# EAGLE design ESP_01_5V (EAGLE 7.2.0)
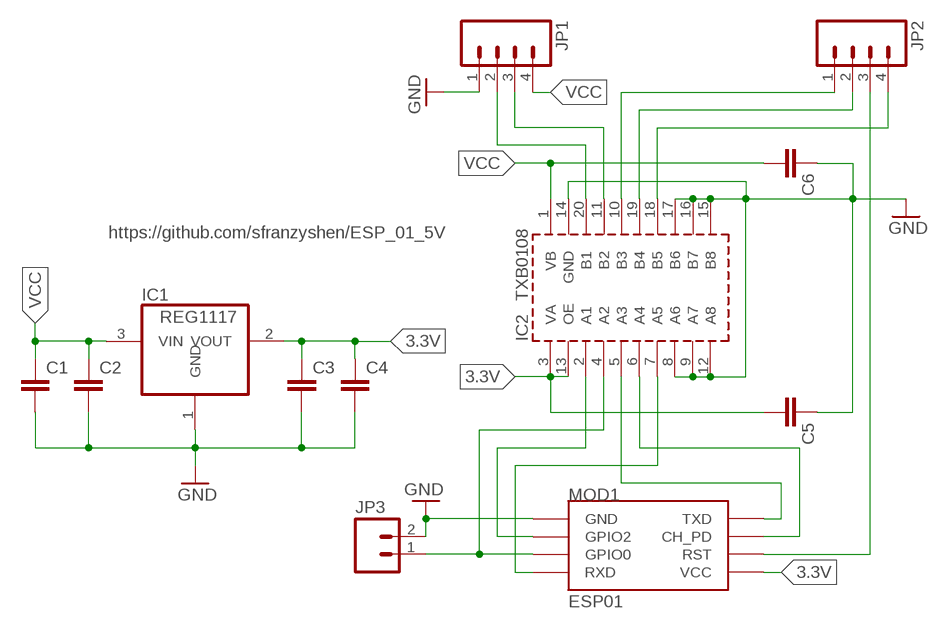
[diagram p0: schematic, sheet 1]

## Parts
C1  CAP0603-CAP  [0603-CAP]
C2  CAP0603-CAP  [0603-CAP]
C3  CAP0603-CAP  [0603-CAP]
C4  CAP0603-CAP  [0603-CAP]
C5  CAP0603-CAP  [0603-CAP]
C6  CAP0603-CAP  [0603-CAP]
IC1  REG1117  [SOT223]
IC2  IC_TXB0108-TSSOP-20  [TSSOP-20]
JP1  .1" 4 Pin Male  M04PTH  [1X04]
JP2  .1" 4 Pin Male  M04PTH  [1X04]
JP3  M02PTH  [1X02]
MOD1  ESP01  [ESP01]

## Nets
3.3V: C3.1 C4.1 C5.2 IC1.2(VOUT) IC2.3(VA) IC2.13(OE) MOD1.VCC
GND: C1.2 C2.2 C3.2 C4.2 C5.1 C6.1 IC1.1(GND) IC2.8(A6) IC2.9(A7) IC2.12(A8) IC2.14(GND) IC2.15(B8) IC2.16(B7) IC2.17(B6) JP1.1 JP3.2 MOD1.GND
N$4: IC2.20(B1) JP1.2
N$5: IC2.11(B2) JP1.3
N$6: IC2.10(B3) JP2.1
N$7: IC2.19(B4) JP2.2
N$8: IC2.18(B5) JP2.4
N$9: JP2.3 MOD1.RST
N$10: IC2.7(A5) MOD1.RX(RXD)
N$11: IC2.2(A1) MOD1.GPIO2
N$12: IC2.4(A2) JP3.1 MOD1.GPIO0
N$13: IC2.5(A3) MOD1.TX(TXD)
N$14: IC2.6(A4) MOD1.CH_PD
VCC: C1.1 C2.1 C6.2 IC1.3(VIN) IC2.1(VB) JP1.4

## Notes on the sheet
- https://github.com/sfranzyshen/ESP_01_5V
- TXB0108

## Library data of the parts
C1-C6 = SparkFun-Capacitors:CAP: Capacitor Standard 0603 ceramic capacitor, and 0.1" leaded capacitor.
IC1 = burr-brown:REG1117: 800mA and 1A Low Dropout (LDO) Positive Regulator 1.8V, 2.5V, 2.85V, 3.3V, 5V, and Adj; MPN: REG1117; OC_FARNELL: 1097566; OC_NEWARK: 14P6981
IC2 = dp_devices:IC_TXB0108: 8-Bit bidirectional voltage level translator Mfr no: TXB0108PWR TXB0108PWR <http://www.digikey.com/product-detail/en/TXB0108PWR/296-21527-2-ND/1305699>
JP1 JP2 = SparkFun-Connectors:M04: Header 4 Standard 4-pin 0.1" header. Use with straight break away headers (SKU : PRT-00116), right angle break away headers (PRT-00553), swiss pins (PRT-00743), machine pins (PRT-00117), and female headers (PRT-00115). Molex polarized connector foot print use with SKU : PRT-08231 with associated crimp pins and housings. 1MM SMD Version SKU: PRT-10208
JP3 = SparkFun-Connectors:M02: Standard 2-pin 0.1" header. Use with - straight break away headers ( PRT-00116) - right angle break away headers (PRT-00553) - swiss pins (PRT-00743) - machine pins (PRT-00117) - female headers (PRT-00115) Molex polarized connector foot print use with: PRT-08233 with associated crimp pins and housings. 2.54_SCREWTERM for use with PRT-10571. 3.5mm Screw Terminal footprints for PRT-08084 5mm Screw Terminal footprints for use with PRT-08432
MOD1 = esp8266modules:ESP01: ESP8266 Wifi module 01

## Board
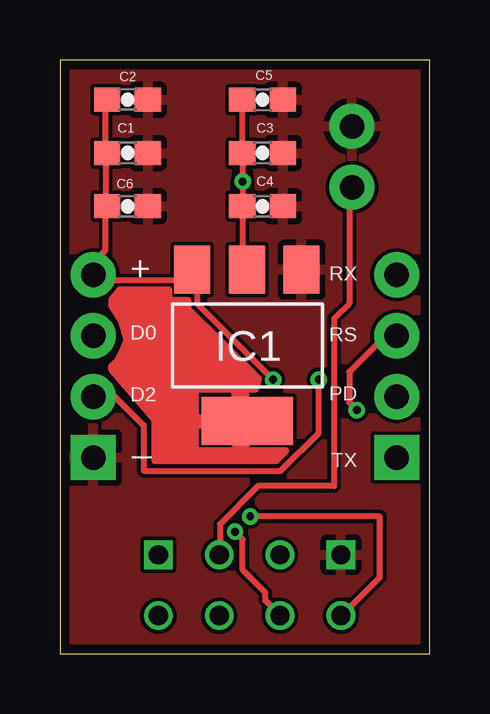
[diagram p1: board, top side]
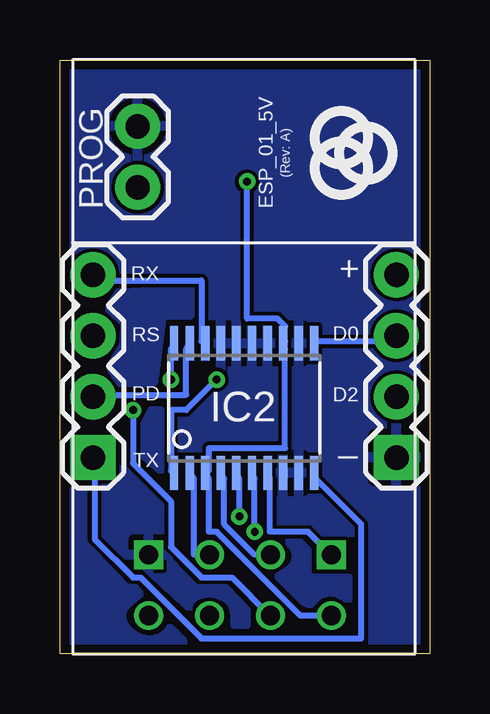
[diagram p2: board, bottom side, seen from below]

Size 15.43 x 24.75 mm. Coordinates in mm from the lower left corner, seen from the top.
Outline: 0,0 15.43,0 15.43,24.75 0,24.75 0,0
Copper layers (1*16): Top 0.0356mm / dielectric 1.5011mm / Bottom 0.0356mm
Design rules "LaenPCBOrder *": minimum track width 10mil, minimum drill 13mil, track to track 6mil, track to pad 6mil, pad to pad 6mil, via to via 6mil, smd to smd 6mil, copper to edge 15mil, drill to drill 6mil, minimum pad ring 7mil, minimum via ring 7mil, stop-mask expansion 3mil, vias tented up to drill 0mil, thermal gap 10mil

### Footprints (pad centres in the part's own frame; a part is rotated, then mirrored left to right if it is on the bottom)
0603-CAP = smd 1.1 x 1: 1 -0.85,0; 2 0.85,0
SOT223 = smd 1.499 x 2.007: 1 -2.261,-3.15; 2 0.025,-3.15; 3 2.311,-3.15 | smd 3.81 x 2.007: 4 0,3.15
TSSOP-20 = smd 0.35 x 1.43: 1 -2.925,-2.7; 2 -2.275,-2.7; 3 -1.625,-2.7; 4 -0.975,-2.7; 5 -0.325,-2.7; 6 0.325,-2.7; 7 0.975,-2.7; 8 1.625,-2.7; 9 2.275,-2.7; 10 2.925,-2.7; 11 2.925,2.7; 12 2.275,2.7; 13 1.625,2.7; 14 0.975,2.7; 15 0.325,2.7; 16 -0.325,2.7; 17 -0.975,2.7; 18 -1.625,2.7; 19 -2.275,2.7; 20 -2.925,2.7
1X04 = drill 1.016 pad 1.88 square: 1 0,0 | drill 1.016 pad 1.88: 2 2.54,0; 3 5.08,0; 4 7.62,0
1X02 = drill 1.016 pad 1.88: 1 0,0; 2 2.54,0
ESP01 = drill 0.8: CH_PD -1.285,-8.178; GPIO0 1.255,-5.638; GPIO2 -1.285,-5.638; RST 1.255,-8.178; TX -3.825,-8.178; VCC 3.795,-8.178 | drill 0.8 square: GND -3.825,-5.638; RX 3.795,-5.638

### Placement (x,y rotation side)
C1  2.82,20.88 0 top
C2  2.82,23.1 0 top
C3  8.45,20.88 0 top
C4  8.45,18.65 0 top
C5  8.45,23.1 180 top
C6  2.82,18.65 180 top
IC1  7.82,12.86 180 top
IC2  7.74,10.24 0 bottom
JP1  1.39,8.18 90 bottom
JP2  14.05,8.18 90 bottom
JP3  12.18,19.45 90 bottom
MOD1  7.9,9.76 0 bottom

### Tracks (layer width: path | path; a pad name or v marks a point on that pad's centre or on a via)
3.3V  (via drill 0.33)
  Top 0.254: C5.2 7.62,22.86 7.62,20.95 C3.1 7.62,20.64 v7.62,19.68 7.62,18.73 C4.1 7.62,18.41 7.62,16.19 IC1.2
  Bottom 0.254: MOD1.VCC 4.13,1.59 5.4,1.59 8.89,5.08 9.21,5.08 9.21,7.3 IC2.3 9.21,7.62 9.21,8.57 6.03,8.57 6.03,12.7 IC2.13 6.03,13.02 6.03,13.65 6.35,13.97 7.62,13.97 v7.62,19.68
GND
  pour Bottom: 0.52,24.92 15.2,24.92 15.2,-0.24 0.52,-0.24
  pour Top: 0.52,24.92 15.12,24.92 15.2,-0.24 0.52,-0.24
N$1
  pour Bottom: 10,15.2 10,14.13 11.19,14.13 11.55,11.31 12.9,11.31 13.3,11.95 12.74,12.82 12.66,13.77 13.37,14.41 12.94,15.04 10.08,15.16
N$2
  pour Top: 11.03,7.34 11.03,8.85 9.56,7.38 10.99,7.38
N$3
  Top 0.305: 4.49,15.16 2.5,15.16 2.18,14.76 2.18,14.49 2.58,13.89 2.78,13.18
N$4  (via drill 0.33)
  Top 0.254: v10.79,11.43 10.79,9.21 9.21,7.62 3.49,7.62 3.49,9.53 2.22,10.79 1.59,10.79 JP1.2
  Bottom 0.254: v10.79,11.43 10.79,12.7 IC2.20
N$5
  Bottom 0.254: IC2.11 4.76,13.02 1.59,13.02 JP1.3
N$6
  Bottom 0.254: IC2.10 4.76,7.3 2.86,5.4 2.86,0.64 9.53,0.64 12.06,3.17 12.38,3.17 13.97,4.76 13.97,7.94 JP2.1
N$7
  Bottom 0.254: IC2.19 10.16,12.7 10.16,10.79 13.97,10.79 JP2.2
N$8
  Bottom 0.254: IC2.18 9.53,13.02 9.53,15.56 13.97,15.56 JP2.4
N$9  (via drill 0.33)
  Top 0.254: v12.38,10.16 12.06,10.48 12.06,11.75 13.34,13.02 13.97,13.02 JP2.3
  Bottom 0.254: v12.38,10.16 12.38,7.94 10.79,6.35 10.79,4.45 9.53,3.17 8.26,3.17 6.67,1.59 MOD1.RST
N$10
  Bottom 0.254: IC2.7 6.67,7.3 6.67,5.08 5.08,5.08 4.13,4.13 MOD1.RX
N$11
  Bottom 0.254: IC2.2 9.84,7.3 9.84,4.13 9.21,4.13 MOD1.GPIO2
N$12
  Top 0.254: MOD1.GPIO0 6.67,4.13 6.67,5.4 8.26,6.99 11.43,6.99 11.43,13.97 12.06,14.61 12.06,19.37 JP3.1
  Bottom 0.254: IC2.4 8.57,7.3 8.57,5.4 7.3,4.13 6.67,4.13 MOD1.GPIO0
N$13  (via drill 0.33)
  Top 0.254: v7.94,5.71 13.34,5.71 13.34,3.17 11.75,1.59 MOD1.TX
  Bottom 0.254: v7.94,5.71 7.94,7.3 IC2.5
N$14  (via drill 0.33)
  Top 0.254: v7.3,5.08 7.62,4.76 7.62,3.49 8.57,2.54 8.57,2.22 8.89,1.91 8.89,1.59 MOD1.CH_PD
  Bottom 0.254: v7.3,5.08 7.3,7.3 IC2.6
N$15
  Top 0.305: 2.82,13.14 2.62,12.62 2.42,12.26 2.22,12.03 2.38,11.63 3.97,9.92 3.97,8.06 9.01,8.06 9.41,8.45 5.71,8.45
N$16
  Top 0.305: 8.21,11.27 8.26,11.47 5.32,14.37 5.32,14.72 4.52,14.72 4.52,15.16
N$17
  Top 0.305: 8.97,8.26 5.4,8.26 5.4,11.19 5.16,11.19 5.16,8.21 4.92,8.21 4.92,11.19 4.72,11.19 4.72,8.21 4.49,8.21 4.49,11.23 4.29,11.23 4.29,8.29 4.21,8.29 4.21,11.23 3.97,11.23 3.97,10.16 2.42,11.99 2.58,12.14 3.85,10.56 3.73,11.23 | 3.73,11.23 3.45,11.23 | 3.73,11.23 8.14,11.23 5.12,14.33 5.12,14.49 4.49,14.53 5.24,14.09 5.32,13.85 7.78,11.35 7.38,11.35 4.49,14.56 4.33,14.49 7.18,11.35 6.79,11.35 4.17,14.45 3.97,14.29 6.63,11.27 6.11,11.39 5.48,12.46 3.81,14.21 5.99,11.39 5.79,11.39 3.61,14.13 3.41,14.05 5.64,11.39 5.24,11.43 3.25,13.97 3.02,13.81 5.08,11.39 4.88,11.39 2.82,13.77 3.02,13.18 4.64,11.43 4.29,11.39 2.94,12.94 2.94,12.54 3.97,11.47 3.53,11.35 2.66,12.3 2.7,12.5 3.65,11.51
N$18
  Top 0.305: 2.3,14.68 2.82,13.89 4.41,14.76 4.29,14.96 2.82,14.21 2.5,14.76 2.66,14.92 2.9,14.49 3.97,15 2.7,14.96 3.17,14.68 3.21,14.8 3.06,14.61
N$19
  Top 0.61: 7.54,10.72 7.54,10.64
N$20
  Top 0.61: 5.83,9.68 5.91,9.68
N$21
  Top 0.61: 7.62,8.65 7.62,8.69
N$22
  Top 0.61: 4.05,9.88 2.3,11.91
N$23
  Top 0.305: 5.64,8.41 5.64,10.95
N$24
  Top 0.305: 5.79,11.03 8.06,11.03
N$25
  Top 0.305: 8.14,11.03 8.26,11.43
N$26
  Top 0.305: 7.3,10.84 7.3,10.72 7.74,10.72 7.74,10.79
N$27
  Top 0.305: 7.34,8.69 7.34,8.65
N$28
  pour Bottom: 14.92,0.48 14.92,6.79 14.45,6.79 14.45,4.64 12.66,2.78 12.26,2.74 12.06,2.5 12.58,2.06 arc-84 12.7,1.19 arc-42 11.91,0.64 arc-76 10.83,1.11 10.04,0.32 14.88,0.32 14.92,0.44
N$29
  pour Bottom: 11.23,10.16 11.23,7.62 11.91,8.22 11.91,9.6 11.63,10.16
N$30
  pour Bottom: 11.47,3.21 10.87,3.21 10.87,3.89 9.76,2.74 8.49,2.74 7.62,1.83 7.62,1.19 8.18,1.19 8.18,1.67 arc-56 8.49,2.26 arc-61 9.76,2.34 arc-62 10.04,1.91
N$31
  pour Bottom: 5.95,4.68 5.44,4.68 5.08,4.33 5.08,3.17 3.37,3.17 3.37,2.26 3.45,2.26 3.73,2.42 arc-84 4.84,2.18 5,2.02 5.24,2.14 6.35,3.21 5.91,3.49 arc-119 5.95,4.64
VCC  (via drill 0.33)
  Top 0.254: C2.1 1.91,22.86 1.91,20.95 C1.1 1.91,20.64 1.91,18.73 C6.2 1.91,18.41 1.91,16.83 1.59,16.51 1.59,15.88 JP1.4 1.59,15.56 5.4,15.56 5.4,15.88 IC1.3 5.71,15.88 5.71,14.61 v8.89,11.43
  Bottom 0.254: v8.89,11.43 10.16,10.16 10.79,10.16 10.79,7.62 IC2.1

### Text on the board
tNames: + | RX | D0 | RS | D2 | PD | _ | TX
bNames: PROG | (Rev: A) | ESP_01_5V | + | RX | D0 | RS | D2 | PD | _ | TX